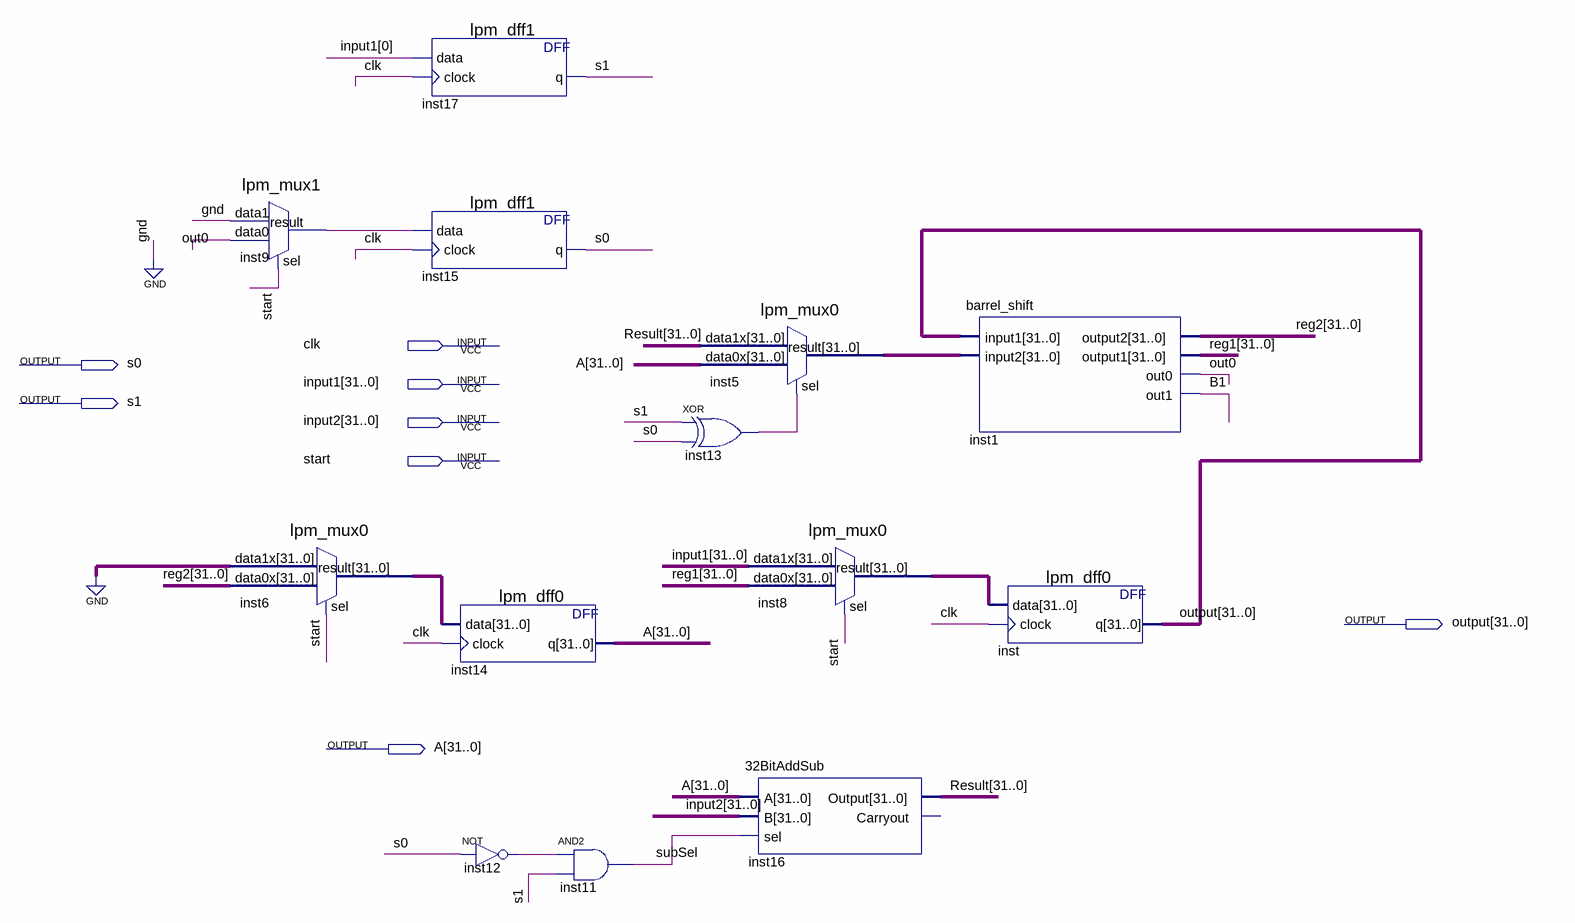
[diagram p0: schematic sheet]
// Quartus schematic alu.bdf as structural Verilog: 13 symbols, 8 pins
module alu (
  input  clk,
  input  [31:0] input1,
  input  [31:0] input2,
  input  start,
  output s0,
  output s1,
  output [31:0] \output ,
  output [31:0] A
);

  wire B1, inst9_result, inst12_out, inst13_out, out0, subSel;
  wire [31:0] inst5_result, inst6_result, inst8_result, reg1, reg2, Result;

  lpm_mux1 inst9 (.data1(1'b0), .data0(out0), .sel(start), .result(inst9_result));
  lpm_mux0 inst6 (.data1x({32{1'b0}}), .data0x(reg2), .sel(start), .result(inst6_result));
  lpm_dff1 inst17 (.data(input1[0]), .clock(clk), .q(s1));
  lpm_dff1 inst15 (.data(inst9_result), .clock(clk), .q(s0));
  lpm_dff0 inst14 (.data(inst6_result), .clock(clk), .q(A));
  not inst12 (inst12_out, s0);
  and inst11 (subSel, inst12_out, s1);
  lpm_mux0 inst5 (.data1x(Result), .data0x(A), .sel(inst13_out), .result(inst5_result));
  xor inst13 (inst13_out, s1, s0);
  lpm_mux0 inst8 (.data1x(input1), .data0x(reg1), .sel(start), .result(inst8_result));
  \32BitAddSub  inst16 (.A(A), .B(input2), .sel(subSel), .Output(Result));  // open: Carryout
  barrel_shift inst1 (.input1(\output ), .input2(inst5_result), .output2(reg2), .output1(reg1), .out0(out0), .out1(B1));
  lpm_dff0 inst (.data(inst8_result), .clock(clk), .q(\output ));
endmodule
